# EAGLE schematic VisualightMicroBulb_02 (EAGLE 6.2)
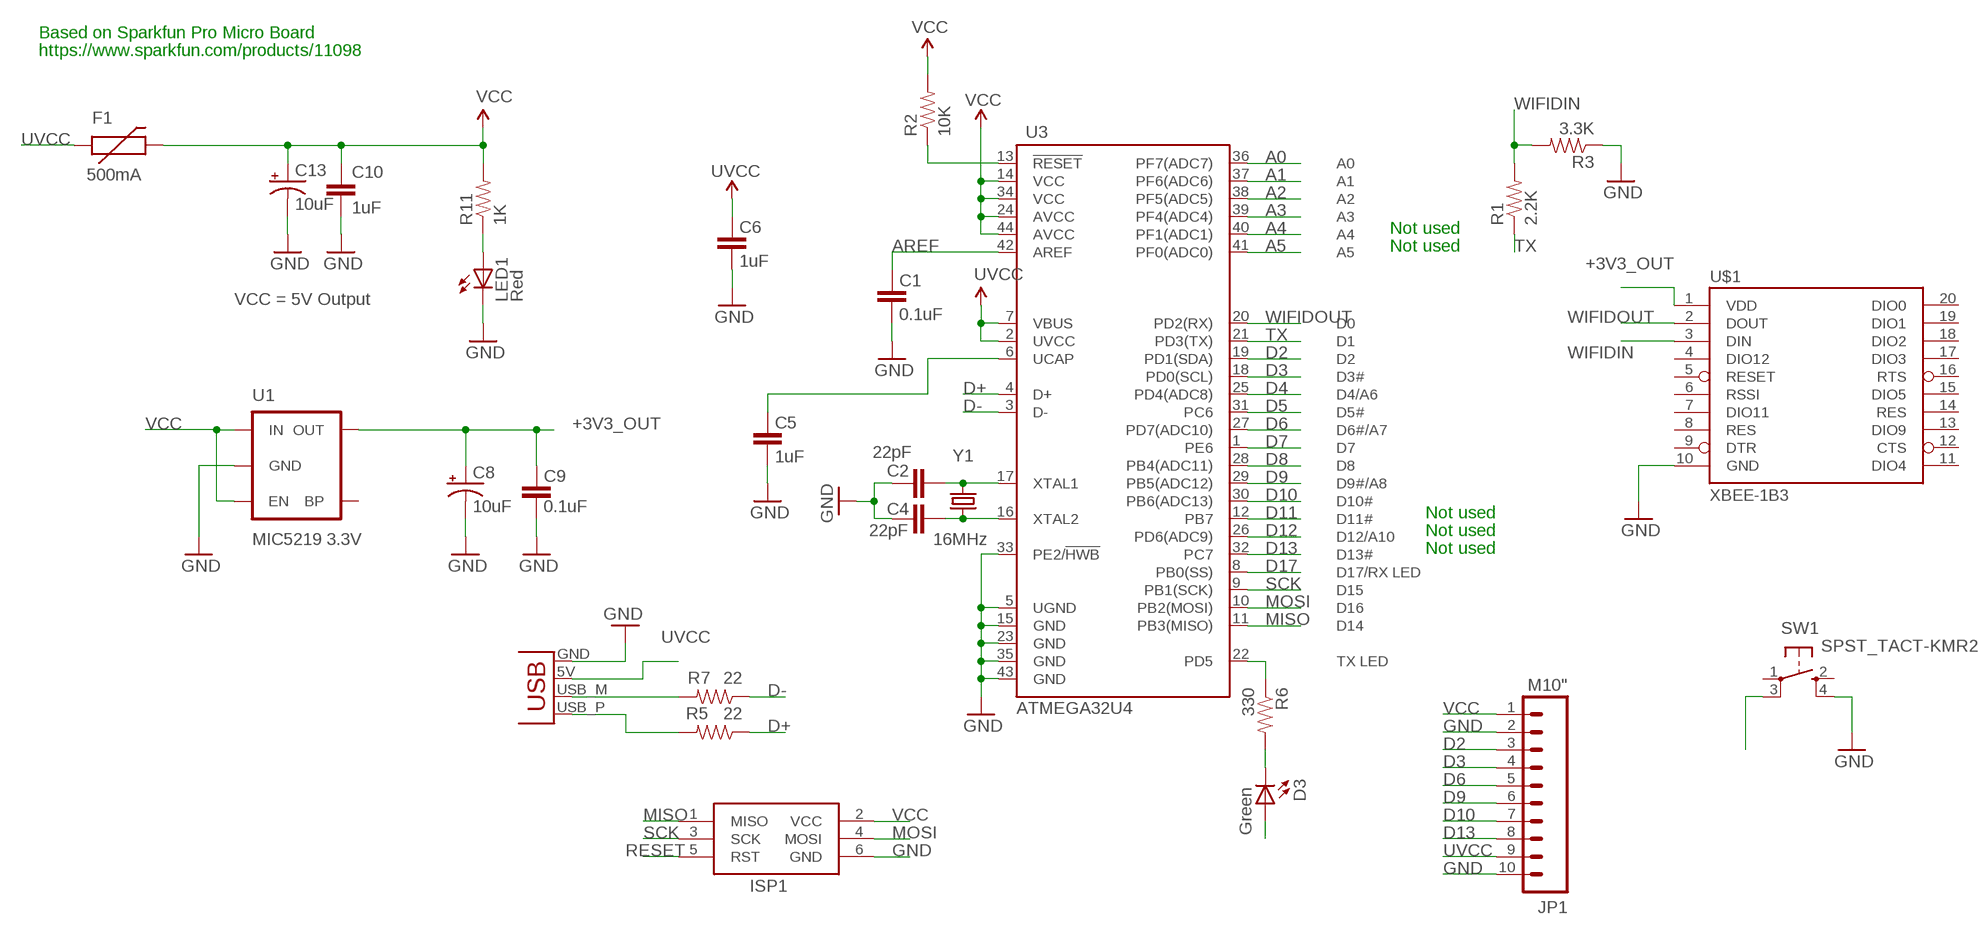
[diagram p0: schematic, sheet 1]

## Parts
C1  0.1uF  CAP0402-CAP  [0402-CAP]
C2  22pF  CAP0402-CAP  [0402-CAP]
C4  22pF  CAP0402-CAP  [0402-CAP]
C5  1uF  CAP0402-CAP  [0402-CAP]
C6  1uF  CAP0402-CAP  [0402-CAP]
C8  10uF  CAP_POL1206  [EIA3216]
C9  0.1uF  CAP0402-CAP  [0402-CAP]
C10  1uF  CAP0402-CAP  [0402-CAP]
C13  10uF  CAP_POL1206  [EIA3216]
D3  Green  LED0603  [LED-0603]
F1  500mA  PTCSMD  [PTC-1206]
ISP1  AVRISP-6  [AVRISP]
JP1  M10"  [1X10]
LED1  Red  LED0603  [LED-0603]
R1  2.2K  RESISTOR0402-RES  [0402-RES]
R2  10K  RESISTOR0402-RES  [0402-RES]
R3  3.3K  RESISTOR0402-RES  [0402-RES]
R5  22  RESISTOR0402-RES  [0402-RES]
R6  330  RESISTOR0402-RES  [0402-RES]
R7  22  RESISTOR0402-RES  [0402-RES]
R11  1K  RESISTOR0402-RES  [0402-RES]
SW1  SPST_TACT-KMR2  [KMR2]
U1  MIC5219 3.3V  V_REG_MIC52193.3V  [SOT23-5]
U3  ATMEGA32U4  ATMEGA32U4TQFP  [SPARKFUN-DIGITALIC_TQFP44]
U$1  XBEE-1B3  [XBEE-SMD]
X2  USBPCB  [USB-A-PCB]
Y1  16MHz  CRYSTAL5X3  [CRYSTAL-SMD-5X3]

## Nets
+3V3_OUT: C8.A(+) C9.2 U1.5(OUT) U$1.1(VDD)
A0: U3.36(PF7(ADC7))
A1: U3.37(PF6(ADC6))
A2: U3.38(PF5(ADC5))
A3: U3.39(PF4(ADC4))
A4: U3.40(PF1(ADC1))
A5: U3.41(PF0(ADC0))
AREF: C1.2 U3.42(AREF)
D2: JP1.3 U3.19(PD1(SDA))
D3: JP1.4 U3.18(PD0(SCL))
D4: U3.25(PD4(ADC8))
D5: U3.31(PC6)
D6: JP1.5 U3.27(PD7(ADC10))
D7: SW1.3(P1) U3.1(PE6)
D8: U3.28(PB4(ADC11))
D9: JP1.6 U3.29(PB5(ADC12))
D10: JP1.7 U3.30(PB6(ADC13))
D11: U3.12(PB7)
D12: U3.26(PD6(ADC9))
D13: JP1.8 U3.32(PC7)
D17: U3.8(PB0(SS))
D+: R5.1 U3.4(D+)
D-: R7.1 U3.3(D-)
GND [vcc]: C1.1 C2.2 C4.2 C5.1 C6.1 C8.C(-) C9.1 C10.2 C13.C(-) ISP1.6(GND) JP1.2 JP1.10 LED1.C R3.1 SW1.4(S1) U1.2(GND) U3.5(UGND) U3.15(GND) U3.23(GND) U3.33(PE2/!HWB) U3.35(GND) U3.43(GND) U$1.10(GND) X2.GND
MISO: ISP1.1(MISO) U3.11(PB3(MISO))
MOSI: ISP1.4(MOSI) U3.10(PB2(MOSI))
N$1: C4.1 U3.16(XTAL2) Y1.1
N$2: C2.1 U3.17(XTAL1) Y1.3
N$4: C5.2 U3.6(UCAP)
N$6: R7.2 X2.USB_M(D-)
N$7: D3.C R6.2
N$8: R5.2 X2.USB_P(D+)
N$38: LED1.A R11.1
RESET: ISP1.5(RST) R2.1 U3.13(!RESET)
SCK: ISP1.3(SCK) U3.9(PB1(SCK))
TX: R1.1 U3.21(PD3(TX))
TXLED: R6.1 U3.22(PD5)
UVCC: C6.2 F1.1 JP1.9 U3.2(UVCC) U3.7(VBUS) X2.5V(VBUS)
VCC: C10.1 C13.A(+) D3.A F1.2 ISP1.2(VCC) JP1.1 R2.2 R11.2 U1.1(IN) U1.3(EN) U3.14(VCC) U3.24(AVCC) U3.34(VCC) U3.44(AVCC)
WIFIDIN: R1.2 R3.2 U$1.3(DIN)
WIFIDOUT: U3.20(PD2(RX)) U$1.2(DOUT)
Unconnected: SW1.1(P) SW1.2(S) U1.4(BP) U$1.4(DIO12) U$1.5(RESET) U$1.6(RSSI) U$1.7(DIO11) U$1.8(RES) U$1.9(DTR) U$1.11(DIO4) U$1.12(CTS) U$1.13(DIO9) U$1.14(RES) U$1.15(DIO5) U$1.16(RTS) U$1.17(DIO3) U$1.18(DIO2) U$1.19(DIO1) U$1.20(DIO0)

## Notes on the sheet
- Based on Sparkfun Pro Micro Board
- https://www.sparkfun.com/products/11098
- Not used
- Not used
- VCC = 5V Output
- Not used
- Not used
- Not used

## Library data of the parts
C1 C2 C4-C6 C9 C10 = SparkFun:CAP: Capacitor Standard 0603 ceramic capacitor, and 0.1" leaded capacitor.
C8 C13 = SparkFun:CAP_POL: Capacitor Polarized These are standard SMD and PTH capacitors. Normally 10uF, 47uF, and 100uF in electrolytic and tantalum varieties. Always verify the external diameter of the through hole cap, it varies with capacity, voltage, and manufacturer. The EIA devices should be standard.
D3 LED1 = SparkFun:LED: LEDs Standard schematic elements and footprints for 5mm, 3mm, 1206, and 0603 sized LEDs. 5mm - Spark Fun Electronics SKU : COM-00529 (and others)
F1 = SparkFun:PTC: Resettable Fuse PTC Resettable Fuse. Spark Fun Electronics SKU : COM-08357
ISP1 = adafruit:AVRISP: AVR ISP HEADER Standard 6 pin header for AVR programming
JP1 = SparkFun-Connectors:M10: Header 10 Standard 10-pin 0.1" header. Use with straight break away headers (SKU : PRT-00116), right angle break away headers (PRT-00553), swiss pins (PRT-00743), machine pins (PRT-00117), and female headers (PRT-00115).
R1-R3 R5-R7 R11 = SparkFun:RESISTOR: Resistor Basic schematic elements and footprints for 0603, 1206, and PTH resistors.
SW1 = adafruit:SPST_TACT: SMT 6mm switch, EVQQ2 series http://www.ladyada.net/library/eagle
U1 = SparkFun-PowerIC:V_REG_MIC5219: V_REG MIC5219 Standard 500mA LDO voltage regulator in SOT-23 layout. Micrel part MIC5219. BP (by-pass) pin is used to lower output noise with 470pF cap, may be left open.; PROD_ID: VREG-09872
U3 = SparkFun-DigitalIC:ATMEGA32U4: Atmel 44-pin 8-bit Microcontroller with 32KBytes of ISP Flash and USB Controller
U$1 = SparkFun-RF:XBEE-1: Xbee module footprints SMT header is CONN-09042.; PROD_ID: CONN-09042
X2 = SparkFun-Connectors:USB: USB Connectors USB-B-PTH is fully proven SKU : PRT-00139/CONN-08278 USB-miniB is fully proven SKU : PRT-00587 USB-A-PCB is untested. USB-A-H is throughly reviewed, but untested. Spark Fun Electronics SKU : PRT-00437 USB-B-SMT is throughly reviewed, but untested. Needs silkscreen touching up. USB-A-S has not been used/tested USB-MB-H has not been used/tested USB-MICROB has been used. CONN-09505
Y1 = SparkFun:CRYSTAL: Crystals Various standard crystals. Proven footprints. Spark Fun Electronics SKU : COM-00534

## Net classes
0 default: width 0.003 mm, drill 0.254 mm, clearance 0.152 mm